# EAGLE schematic C10 (EAGLE 7.5.0)
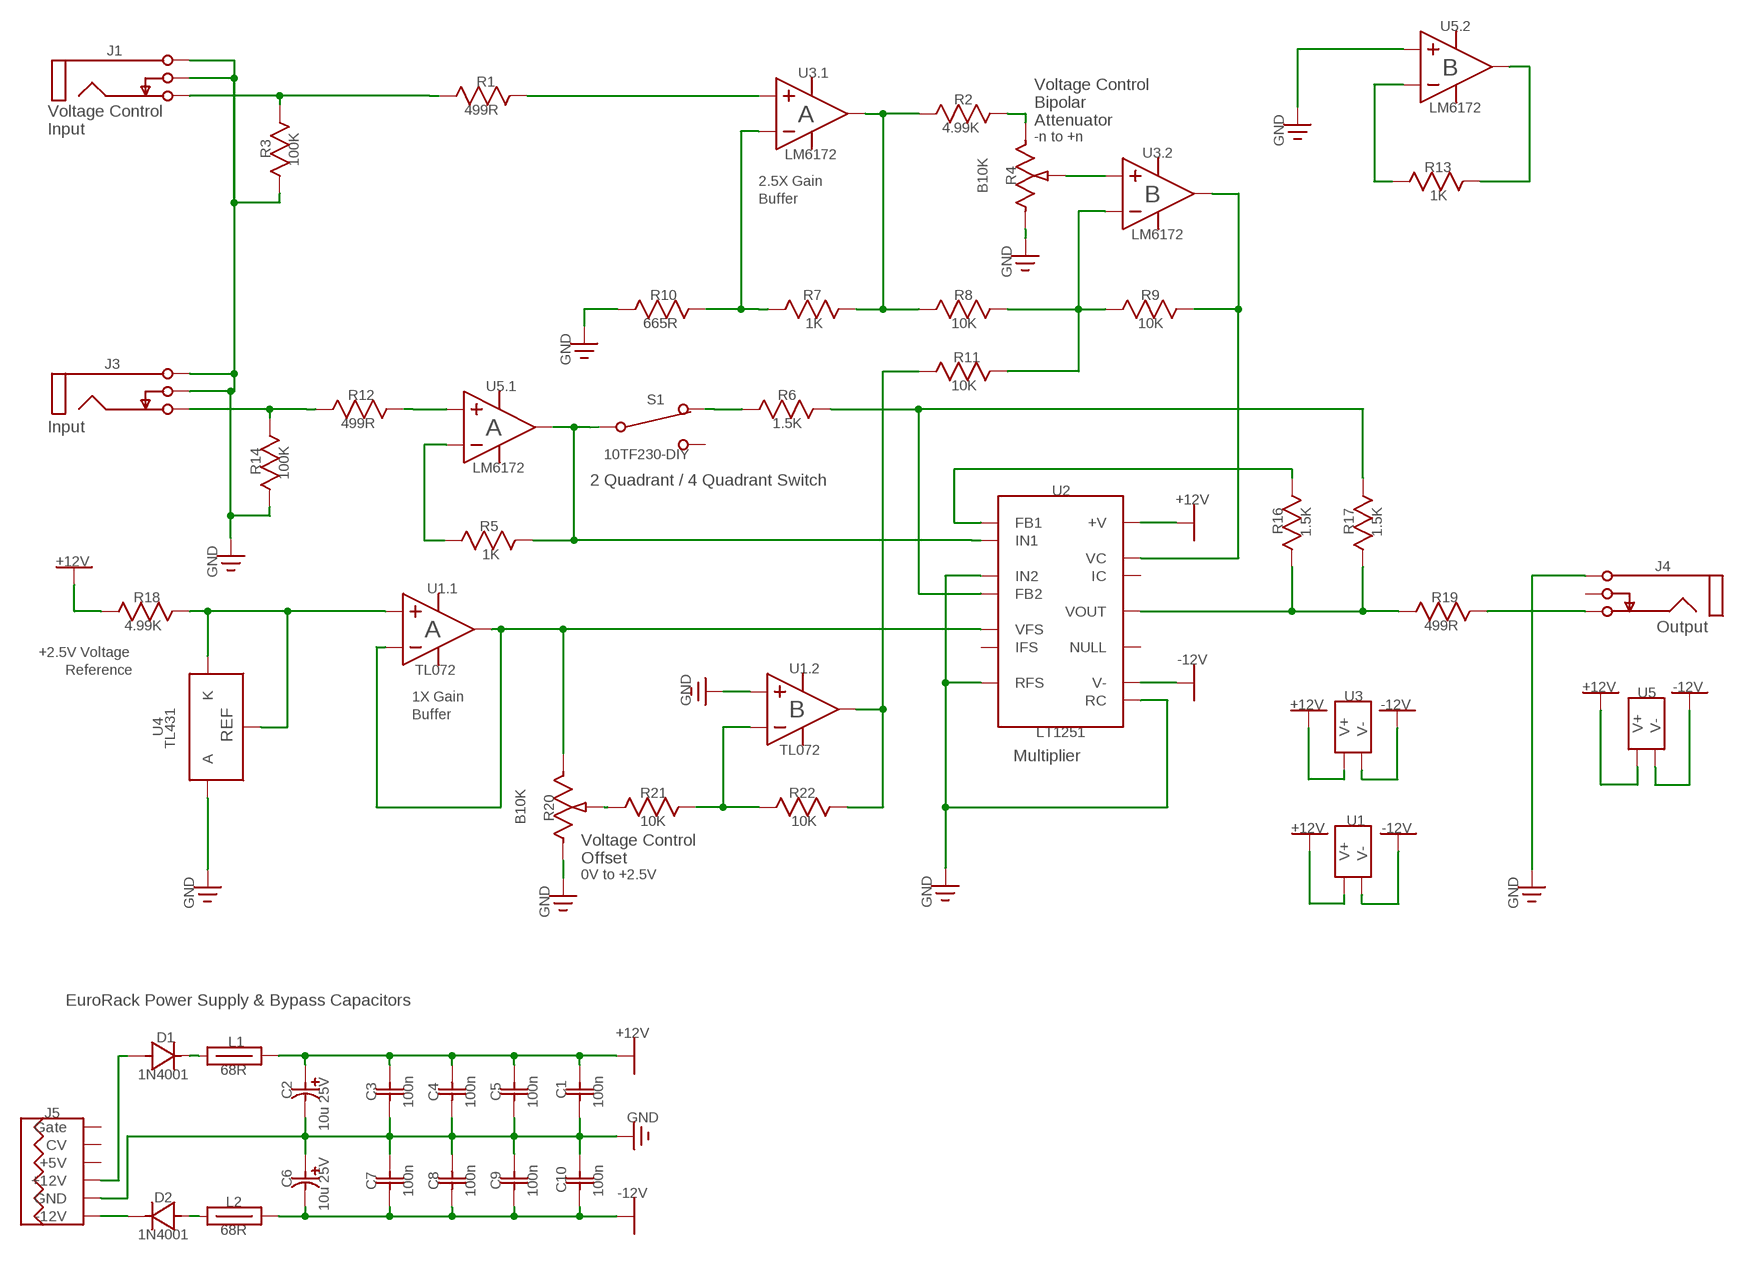
[diagram p0: schematic, sheet 1]

## Parts
C1  100n  CAP100  [CAP-2.54/6.6X3]
C2  10u 25V  EC80-5  [CAPPR-2/5.08]
C3  100n  CAP100  [CAP-2.54/6.6X3]
C4  100n  CAP100  [CAP-2.54/6.6X3]
C5  100n  CAP100  [CAP-2.54/6.6X3]
C6  10u 25V  EC80-5  [CAPPR-2/5.08]
C7  100n  CAP100  [CAP-2.54/6.6X3]
C8  100n  CAP100  [CAP-2.54/6.6X3]
C9  100n  CAP100  [CAP-2.54/6.6X3]
C10  100n  CAP100  [CAP-2.54/6.6X3]
D1  1N4001  [DO-41]
D2  1N4001  [DO-41]
J1  PJ302M  [PJ302M]
J3  PJ302M  [PJ302M]
J4  PJ302M_1  [PJ302M]
J5  EUROPWR16  [IDC16M]
L1  68R  2743001111  [FB-10.16/4.45X3.5]
L2  68R  2743001111  [FB-10.16/4.45X3.5]
R1  499R  RES300  [RES-7.62/5.1X2.5]
R2  4.99K  RES300  [RES-7.62/5.1X2.5]
R3  100K  RES300  [RES-7.62/5.1X2.5]
R4  B10K  ALPHA9H  [ALPHA9H]
R5  1K  RES300  [RES-7.62/5.1X2.5]
R6  1.5K  RES300  [RES-7.62/5.1X2.5]
R7  1K  RES300  [RES-7.62/5.1X2.5]
R8  10K  RES300  [RES-7.62/5.1X2.5]
R9  10K  RES300  [RES-7.62/5.1X2.5]
R10  665R  RES300  [RES-7.62/5.1X2.5]
R11  10K  RES300  [RES-7.62/5.1X2.5]
R12  499R  RES300  [RES-7.62/5.1X2.5]
R13  1K  RES300  [RES-7.62/5.1X2.5]
R14  100K  RES300  [RES-7.62/5.1X2.5]
R16  1.5K  RES300  [RES-7.62/5.1X2.5]
R17  1.5K  RES300  [RES-7.62/5.1X2.5]
R18  4.99K  RES300  [RES-7.62/5.1X2.5]
R19  499R  RES300  [RES-7.62/5.1X2.5]
R20  B10K  ALPHA9H  [ALPHA9H]
R21  10K  RES300  [RES-7.62/5.1X2.5]
R22  10K  RES300  [RES-7.62/5.1X2.5]
S1  10TF230-DIY  [10TF230-DIY]
U1  TL072  [DIP-8]
U2  LT1251  [DIP-14]
U3  LM6172  [DIP-8]
U4  TL431  [TO-92-100R]
U5  LM6172  [DIP-8]

## Nets
0V: C1.2 C2.2(MINUS) C3.2 C4.2 C5.2 C6.1(PLUS) C7.1 C8.1 C9.1 C10.1 J1.1A(Sleeve) J1.1B(Sleeve) J1.2A(Switch) J1.2B(Switch) J3.1A(Sleeve) J3.1B(Sleeve) J3.2A(Switch) J3.2B(Switch) J4.1A(Sleeve) J4.1B(Sleeve) J5.3(GND) J5.4(GND) J5.5(GND) R3.1(A) R4.1(CCW) R10.1(A) R14.1(A) R20.1(CCW) U1.5(PART_2:IN+) U2.5(RC) U2.10(RFS) U2.14(IN2) U4.2(A) U5.5(PART_2:IN+) ; supply symbol labelled GND
+2.5V_Reference: R20.3(CW) U1.1(PART_1:OUT) U1.2(PART_1:IN-) U2.12(VFS)
+12V: C1.1 C2.1(PLUS) C3.1 C4.1 C5.1 L1.2 R18.2(B) U1.8(VCC_AND_GND:V+) U2.9(+V) U3.8(VCC_AND_GND:V+) U5.8(VCC_AND_GND:V+)
-12V: C6.2(MINUS) C7.2 C8.2 C9.2 C10.2 L2.2 U1.4(VCC_AND_GND:V-) U2.7(V-) U3.4(VCC_AND_GND:V-) U5.4(VCC_AND_GND:V-)
BIAS_CTRL_BUFFERED: R11.1(A) R22.2(B) U1.7(PART_2:OUT)
BUFFERED_VC_TO_FADER: R9.2(B) U2.3(VC) U3.7(PART_2:OUT)
Net_0: R6.1(A) S1.1(C3) S1.1B(C3)
Net_1: D2.2(A) L2.1
Net_2: D1.1(K) L1.1
Net_5: D2.1(K) J5.1(-12V) J5.2(-12V)
Net_10: R1.2(B) U3.3(PART_1:IN+)
Net_13: R12.2(B) U5.3(PART_1:IN+)
Net_17: R2.2(B) R4.3(CW)
Net_23: R4.2(W) U3.5(PART_2:IN+)
Net_26: R5.1(A) U5.2(PART_1:IN-)
Net_27: R5.2(B) S1.2(C1) S1.2B(C1) U2.1(IN1) U5.1(PART_1:OUT)
Net_28: R20.2(W) R21.1(A)
Net_29: R13.1(A) U5.6(PART_2:IN-)
Net_30: R13.2(B) U5.7(PART_2:OUT)
Net_33: D1.2(A) J5.9(+12V) J5.10(+12V)
Net_34: J4.3A(Tip) J4.3B(Tip) R19.2(B)
Net_45: R16.1(A) R17.2(B) R19.1(A) U2.8(VOUT)
Net_46: R6.2(B) R17.1(A) U2.13(FB2)
Net_49: R16.2(B) U2.2(FB1)
Net_50: R18.1(A) U1.3(PART_1:IN+) U4.1(K) U4.3(REF)
Net_52: R7.1(A) R10.2(B) U3.2(PART_1:IN-)
Net_53: R2.1(A) R7.2(B) R8.1(A) U3.1(PART_1:OUT)
Net_54: R8.2(B) R9.1(A) R11.2(B) U3.6(PART_2:IN-)
Net_58: J1.3A(Tip) J1.3B(Tip) R1.1(A) R3.2(B)
Net_60: R21.2(B) R22.1(A) U1.6(PART_2:IN-)
Net_64: J3.3A(Tip) J3.3B(Tip) R12.1(A) R14.2(B)
Unconnected: J4.2A(Switch) J4.2B(Switch) J5.11(+5V) J5.12(+5V) J5.13(CV) J5.14(CV) J5.15(Gate) J5.16(Gate) S1.3(C2) S1.3B(C2) U2.4(IC) U2.6(NULL) U2.11(IFS)

## Notes on the sheet
- U5.2
- J1 | B
- U3.1 | Voltage Control
- R1
- Bipolar
- Voltage Control | 499R | A | R2 | LM6172
- Attenuator
- Input | 4.99K
- -n to +n
- LM6172 | GND
- R3 | U3.2
- 100K
- 2.5X Gain | R13
- R4 | B
- Buffer | B10K | 1K
- LM6172
- GND
- R10 | R7 | R8 | R9
- 665R | 1K | 10K | 10K
- GND | R11
- J3
- 10K
- U5.1
- R12 | R6
- S1
- Input | 499R | A | 1.5K
- 10TF230-DIY
- LM6172
- R14 | 2 Quadrant / 4 Quadrant Switch
- 100K
- U2
- +12V
- R5 | R16 | R17
- 1.5K | 1.5K
- 1K
- +12V
- J4
- GND
- U1.1
- R18 | R19
- 4.99K | A | 499R | Output
- +2.5V Voltage
- Reference | TL072 | -12V
- U1.2
- 1X Gain | +12V | -12V
- B | U3 | U5
- Buffer | GND | +12V | -12V
- LT1251
- U4
- REF | TL072
- TL431 | Multiplier
- R21 | R22
- 10K | 10K
- B10K | R20
- U1
- Voltage Control | +12V | -12V
- Offset
- 0V to +2.5V
- GND | GND | GND
- GND
- EuroRack Power Supply & Bypass Capacitors
- +12V
- D1
- L1
- 68R
- 1N4001
- C2 | C3 | C4 | C5 | C1
- 100n | 100n | 100n | 100n
- J5
- GND
- 10u 25V
- C6 | C7 | C8 | C9
- 100n | 100n | 100n | C10
- 100n | -12V
- D2
- L2 | 10u 25V
- 68R
- 1N4001

## Library data of the parts
C1 C3-C5 C7-C10 = common:CAP100
C2 C6 = common:EC80-5
D1 D2 = common:1N4001
J1 J3 = common:PJ302M; DATASHEET: http://www.thonk.co.uk/shop/pj302m/
J4 = common:PJ302M_1; DATASHEET: http://www.thonk.co.uk/shop/pj302m/
J5 = common:EUROPWR16
L1 L2 = common:2743001111; MANUFACTURER: Fair-Rite
R1 R12 R19 = common:RES300
R2 R3 R5-R11 R13 R14 R16-R18 R21 R22 = common:RES300; VALUE: 499R
R4 R20 = common:ALPHA9H; DATASHEET: http://www.thonk.co.uk/shop/alpha-9mm-pots/; MANUFACTURER: Alpha
S1 = common:10TF230-DIY
U1 = common:TL072; DATASHEET: http://datasheets.diptrace.com\ti\TL07x.pdf; MANUFACTURER: Texas Instruments
U2 = common:LT1251; DATASHEET: http://datasheets.diptrace.com\linear\LT1251_1256.pdf; MANUFACTURER: Linear
U3 U5 = common:LM6172; DATASHEET: http://www.ti.com/lit/gpn/lm6172; MANUFACTURER: Texas Instruments
U4 = common:TL431; DATASHEET: http://datasheets.diptrace.com\st_micro\CD00000986.pdf; MANUFACTURER: ST Microelectronics